# Altium schematic sheet FTDI_USB_To_UART.SchDoc
size A3; SheetNumber: 5; SheetTotal: 6
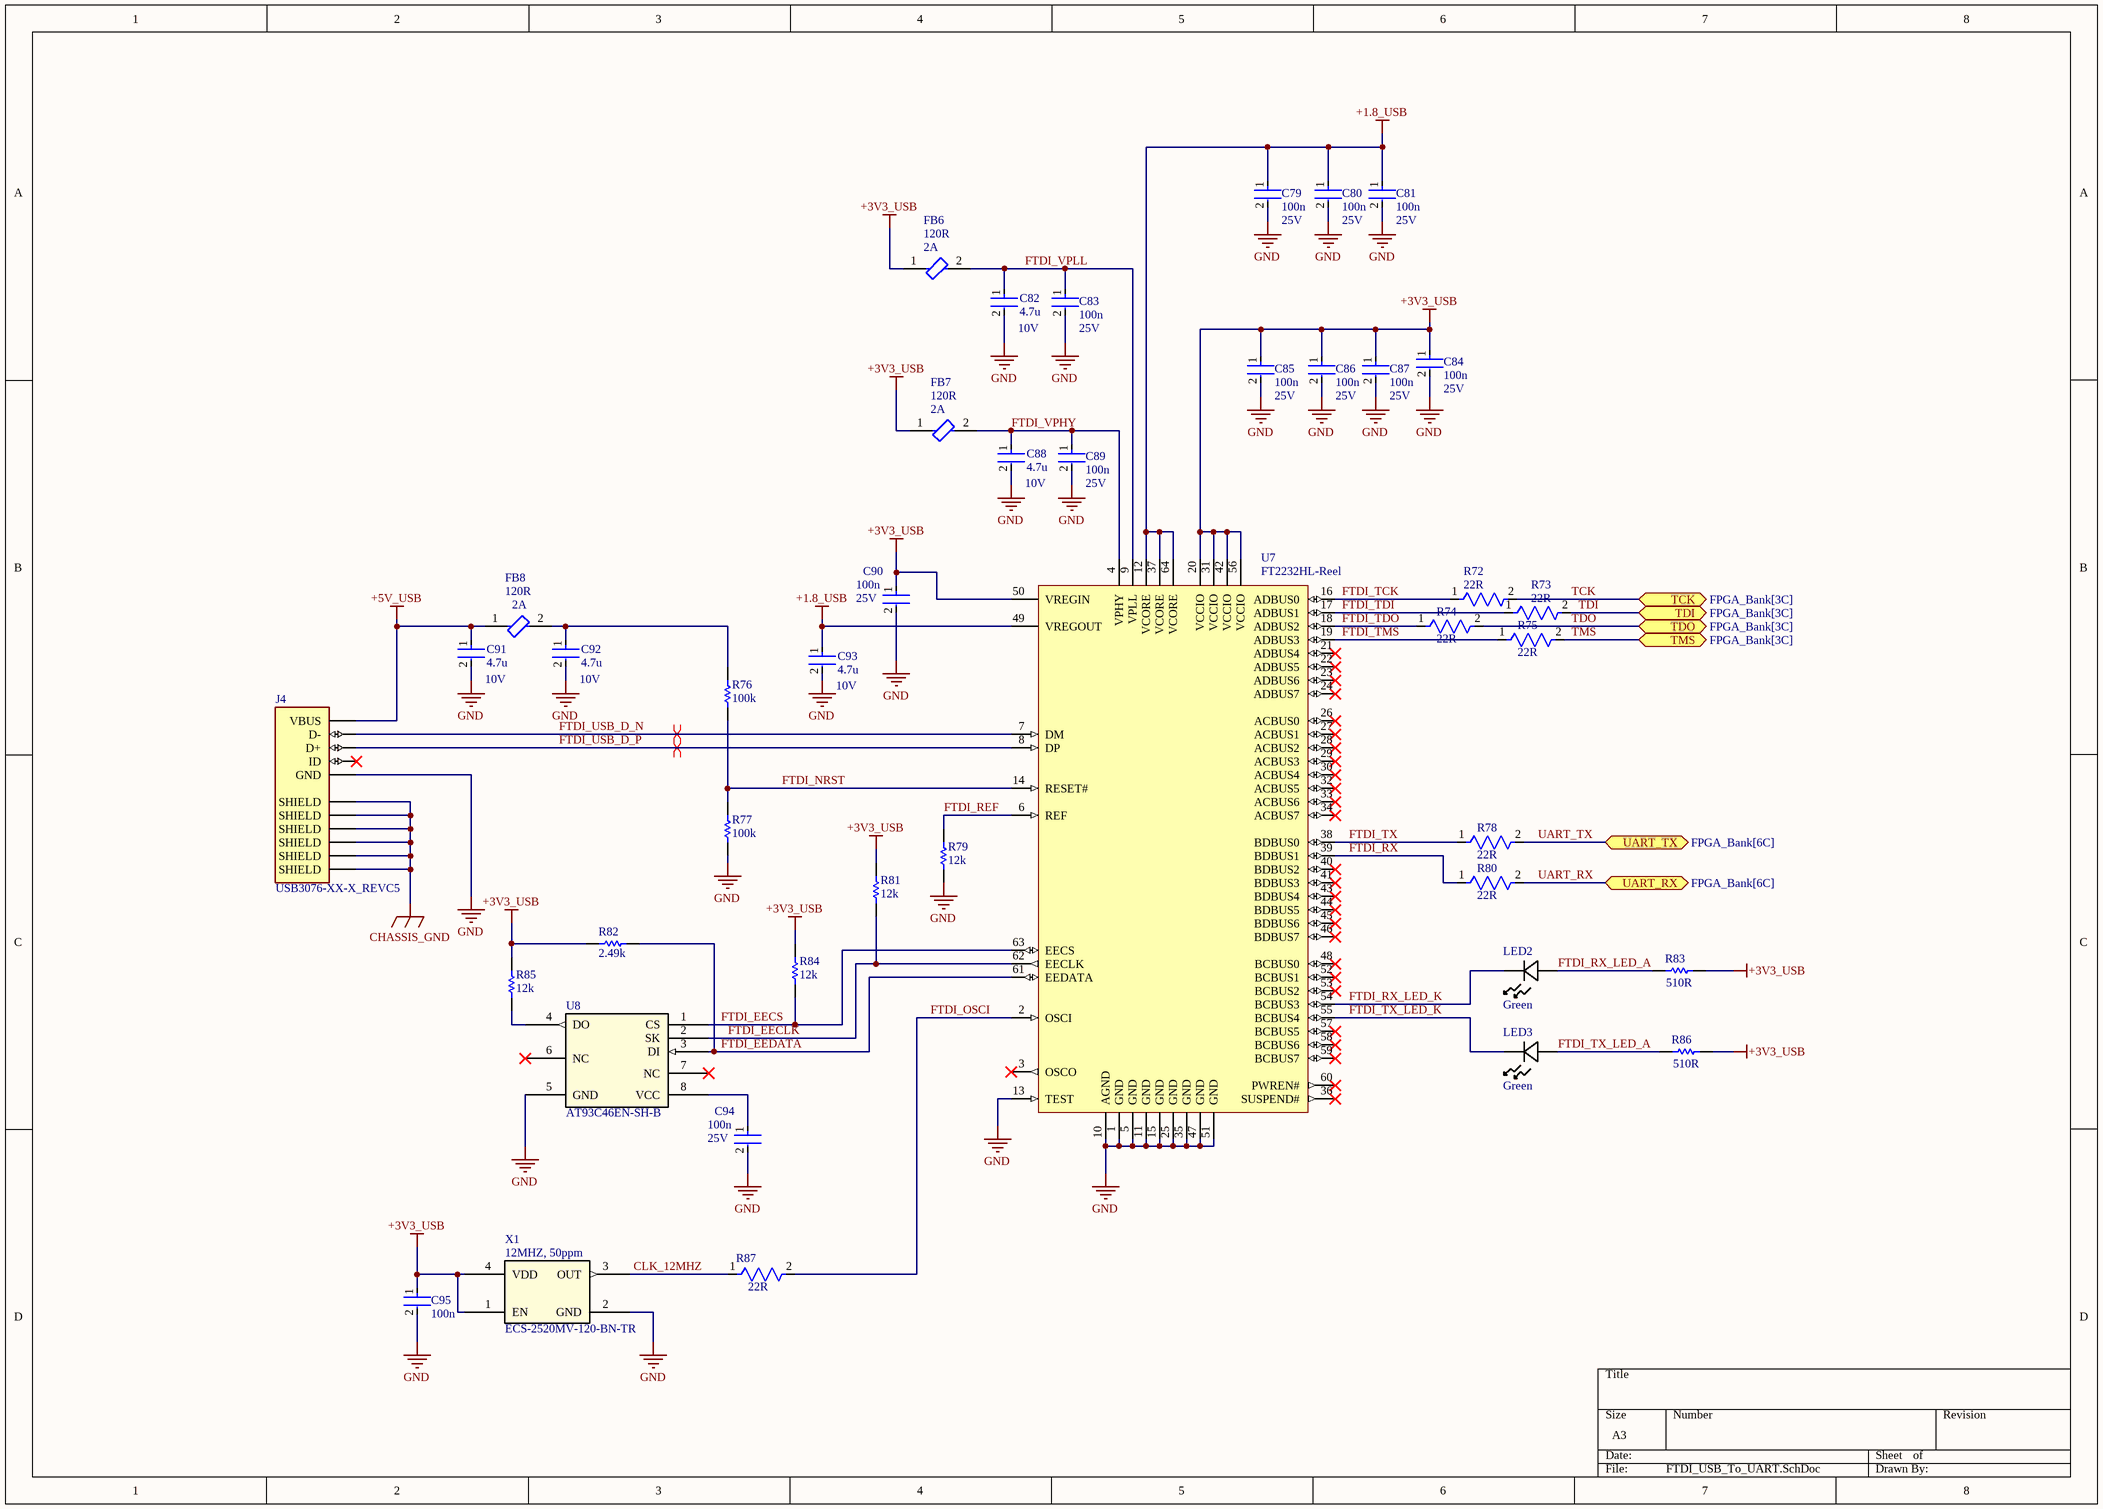
[diagram p0: FTDI_USB_To_UART.SchDoc]

## Parts
C79  100n  [FP-CL278-IPC_C]
C80  100n  [FP-CL278-IPC_C]
C81  100n  [FP-CL278-IPC_C]
C82  4.7u  [FP-CL282-IPC_C]
C83  100n  [FP-CL278-IPC_C]
C84  100n  [FP-CL278-IPC_C]
C85  100n  [FP-CL278-IPC_C]
C86  100n  [FP-CL278-IPC_C]
C87  100n  [FP-CL278-IPC_C]
C88  4.7u  [FP-CL282-IPC_C]
C89  100n  [FP-CL278-IPC_C]
C90  100n  [FP-CL278-IPC_C]
C91  4.7u  [FP-CL282-IPC_C]
C92  4.7u  [FP-CL282-IPC_C]
C93  4.7u  [FP-CL282-IPC_C]
C94  100n  [FP-CL278-IPC_C]
C95  100n  [FP-CL278-IPC_C]
FB6  120R  [FP-BLM15-0_05-d0_7-MFG]
FB7  120R  [FP-BLM15-0_05-d0_7-MFG]
FB8  120R  [FP-BLM15-0_05-d0_7-MFG]
J4  USB3076-XX-X_REVC5  [GCT_USB3076-XX-X_REVC5]
LED2  Green  [LED_LTW-C193TS5_LTO]
LED3  Green  [LED_LTW-C193TS5_LTO]
R72  22R  [FP-RC0402-0_4-MFG]
R73  22R  [FP-RC0402-0_4-MFG]
R74  22R  [FP-RC0402-0_4-MFG]
R75  22R  [FP-RC0402-0_4-MFG]
R76  100k  [RESC1005X40X25NL05T10]
R77  100k  [RESC1005X40X25NL05T10]
R78  22R  [FP-RC0402-0_4-MFG]
R79  12k  [RESC1005X40X25NL05T10]
R80  22R  [FP-RC0402-0_4-MFG]
R81  12k  [RESC1005X40X25NL05T10]
R82  2.49k  [RESC1005X40X25NL05T10]
R83  510R  [RESC1005X40X25LL05T05]
R84  12k  [RESC1005X40X25NL05T10]
R85  12k  [RESC1005X40X25NL05T10]
R86  510R  [RESC1005X40X25LL05T05]
R87  22R  [FP-RC0402-0_4-MFG]
U7  FT2232HL-Reel  [LQFP-64_M]
U8  AT93C46EN-SH-B  [8S1_ATM]
X1  ECS-2520MV-120-BN-TR  [SMD4_ECS-2520MV_ECS]

## Ports
TCK (bidir, see FPGA_Bank[3C]), TDI (bidir, see FPGA_Bank[3C]), TDO (bidir, see FPGA_Bank[3C]), TMS (bidir, see FPGA_Bank[3C]), UART_RX (bidir, see FPGA_Bank[6C]), UART_TX (bidir, see FPGA_Bank[6C])

## Nets
+1.8_USB: C79.1 C80.1 C81.1 C93.1 U7.12(VCORE) U7.37(VCORE) U7.49(VREGOUT) U7.64(VCORE)
+3V3_USB: C84.1 C85.1 C86.1 C87.1 C90.1 C95.1 FB6.1 FB7.1 R81.2 R82.1 R83.2 R84.2 R85.2 R86.2 U7.20(VCCIO) U7.31(VCCIO) U7.42(VCCIO) U7.50(VREGIN) U7.56(VCCIO) X1.1(EN) X1.4(VDD)
+5V_USB: C91.1 FB8.1 J4.1(VBUS)
CHASSIS_GND: J4.6(SHIELD) J4.7(SHIELD) J4.8(SHIELD) J4.9(SHIELD) J4.10(SHIELD) J4.11(SHIELD)
GND: C79.2 C80.2 C81.2 C82.2 C83.2 C84.2 C85.2 C86.2 C87.2 C88.2 C89.2 C90.2 C91.2 C92.2 C93.2 C94.2 C95.2 J4.5(GND) R77.1 R79.1 U7.1(GND) U7.5(GND) U7.10(AGND) U7.11(GND) U7.13(TEST) U7.15(GND) U7.25(GND) U7.35(GND) U7.47(GND) U7.51(GND) U8.5(GND) X1.2(GND)
CLK_12MHZ: R87.1 X1.3(OUT)
FTDI_EECLK: R81.1 U7.62(EECLK) U8.2(SK)
FTDI_EECS: R84.1 U7.63(EECS) U8.1(CS)
FTDI_EEDATA: R82.2 U7.61(EEDATA) U8.3(DI)
FTDI_NRST: R76.1 R77.2 U7.14(RESET#)
FTDI_OSCI: R87.2 U7.2(OSCI)
FTDI_REF: R79.2 U7.6(REF)
FTDI_RX: R80.1 U7.39(BDBUS1)
FTDI_RX_LED_A: LED2.2 R83.1
FTDI_RX_LED_K: LED2.1 U7.54(BCBUS3)
FTDI_TCK: R72.1 U7.16(ADBUS0)
FTDI_TDI: R73.1 U7.17(ADBUS1)
FTDI_TDO: R74.1 U7.18(ADBUS2)
FTDI_TMS: R75.1 U7.19(ADBUS3)
FTDI_TX: R78.1 U7.38(BDBUS0)
FTDI_TX_LED_A: LED3.2 R86.1
FTDI_TX_LED_K: LED3.1 U7.55(BCBUS4)
FTDI_USB_D_N: J4.2(D-) U7.7(DM)
FTDI_USB_D_P: J4.3(D+) U7.8(DP)
FTDI_VPHY: C88.1 C89.1 FB7.2 U7.4(VPHY)
FTDI_VPLL: C82.1 C83.1 FB6.2 U7.9(VPLL)
TCK: R72.2 ; port TCK
TDI: R73.2 ; port TDI
TDO: R74.2 ; port TDO
TMS: R75.2 ; port TMS
UART_RX: R80.2 ; port UART_RX
UART_TX: R78.2 ; port UART_TX
NetC92_1: C92.1 FB8.2 R76.2
NetC94_1: C94.1 U8.8(VCC)
NetR85_1: R85.1 U8.4(DO)

Not connected (* = marked no-connect by the designer): J4 4(ID)*; U7 3(OSCO)* 21(ADBUS4)* 22(ADBUS5)* 23(ADBUS6)* 24(ADBUS7)* 26(ACBUS0)* 27(ACBUS1)* 28(ACBUS2)* 29(ACBUS3)* 30(ACBUS4)* 32(ACBUS5)* 33(ACBUS6)* 34(ACBUS7)* 36(SUSPEND#)* 40(BDBUS2)* 41(BDBUS3)* 43(BDBUS4)* 44(BDBUS5)* 45(BDBUS6)* 46(BDBUS7)* 48(BCBUS0)* 52(BCBUS1)* 53(BCBUS2)* 57(BCBUS5)* 58(BCBUS6)* 59(BCBUS7)* 60(PWREN#)*; U8 6(NC)* 7(NC)*

## Layout directives
differential pair: FTDI_USB_D_N, FTDI_USB_D_P

## Notes on the sheet
- 25V
- (near C81) 25V
- (near FB6) 2A
- 10V
- (near C83) 25V
- (near FB7) 2A
- (near C84) 25V
- (near C89) 25V
- (near FB8) 2A
- (near C90) 25V
- (near C91) 10V
- (near C92) 10V
- (near C93) 10V
- (near C94) 25V
- (near X1) 12MHZ, 50ppm

## Library data of the parts
C79-C81 C83-C87 C89 C90 C94 C95 = CMP-13271-000728-1: Cap Ceramic 100nF 25V X5R ±10% SMD 0402 +85°C Paper T/R; Package Quantity: 1; Height: 0.5mm; Case Code (Metric): 1005; Thickness: 0.022inch; Mount: Surface Mount; Lead Free: Lead Free; Case Code (Imperial): 0402; Packaging: Tape and Reel; Depth: 0.5mm; Voltage: 25V; Min Operating Temperature: -55°C; Voltage Rating: 25V; Dielectric: X5R; Case/Package: 0402; Tolerance: 10%; Width: 0.02inch; Max Operating Temperature: 85°C; Capacitance: 100nF; Length: 1mm; Radiation Hardening: No; Voltage Rating (DC): 25V
C82 C88 C91-C93 = CMP-13271-000548-1: Cap Ceramic 4.7uF 10V X5R ±20% SMD 0402 +85°C Paper T/R; Capacitance: 4.7uF; Max Operating Temperature: 85°C; Lead Free: Lead Free; Tolerance: 20%; Voltage Rating: 10V; Dielectric: X5R; Width: 0.02inch; Length: 0.039inch; Case/Package: 0402; Min Operating Temperature: -55°C; Packaging: Tape and Reel; Thickness: 0.022inch; Case Code (Imperial): 0402; Package Quantity: 10000; Case Code (Metric): 1005; Mount: Surface Mount
FB6-FB8 = CMP-0686-00133-3: Chip Ferrite Bead, 0402, 120Ω @ 100MHz, 0.055Ω, 25%, 2A; DC Resistance (DCR): 55mR; Number of Circuits: 1; Material: Steel; Lead Free: Lead Free; Package Quantity: 10000; Impedance: 120R; Width: 0.5mm; Case Code (Metric): 1005; Test Frequency: 100MHz; Weight: 2.3E-05oz; Max DC Current: 2A; Current Rating: 2A; REACH SVHC: No SVHC; Case Code (Imperial): 0402; Min Operating Temperature: -55°C; Max Operating Temperature: 125°C; Max Current Rating: 2A; Series: EMIFIL®, BLM15P; Tolerance: 25%; Termination: SMD/SMT; Number of Lines: 1; Case/Package: 0402; RoHS Compliant: Yes; Number of Pins: 2; Length: 1mm; Height: 0.5mm; Packaging: Tape and Reel
J4 = USB3076-XX-X_REVC5: USB - micro B USB 2.0 Receptacle Connector 5 Position Surface Mount, Right Angle; Through Hole, 2.35mm profile, 5 Pins, Horizontal, Bottom mount; MP: USB3076-30-A; MF: Global Connector Technology; SnapEDA_Link: https://www.snapeda.com/parts/USB3076-30-A/Global+Connector+Technology/view-part/?ref=snap; Package: None; Check_prices: https://www.snapeda.com/parts/USB3076-30-A/Global+Connector+Technology/view-part/?ref=eda; Purchase-URL: https://pricing.snapeda.com/search/part/USB3076-30-A/?ref=eda; Price: None; Value: *; Availability: In Stock
LED2 LED3 = LTST-C191TGKT: No Description Available; Manufacturer_Name: LITE-ON; Copyright: Copyright (C) 2025 Ultra Librarian. All rights reserved.; Manufacturer_Part_Number: LTST-C191TGKT
R72-R75 R78 R80 R87 = CMP-2002-07520-2: Tolerance: 1%; Power Rating: 63mW; Voltage Rating: 50V; Temperature Coefficient: 100ppm/°C; Resistance: 22Ω; Termination: SMD/SMT; Depth: 500µm; Packaging: Tape & Reel; Height: 400µm; Width: 500µm; Case Code (Imperial): 0402; Length: 1mm; Schedule B: 8533210045, 8533210045; Case/Package: 0402; Max Operating Temperature: 155°C; Min Operating Temperature: -55°C; REACH SVHC: Unknown; RoHS: Compliant; Military Standard: Not; Voltage Rating (DC): 50V; Lead Free: Lead Free; Voltage Rating (AC): 50V; Number of Pins: 2; Composition: Thick Film
R76 R77 R79 R81 R84 R85 = CMP-2002-07343-1: Part Number: RC0402FR-07100KL; Manufacturer: Yageo / Phycomp
R82 = CMP-2002-07571-1: Part Number: RC0402FR-072K49L; Manufacturer: Yageo
R83 R86 = CMP-2002-00074-1: Part Number: CRCW0402510RFKED; Manufacturer: Vishay Dale
U7 = CMP-0078-00023-3: Dual High Speed USB To Multipurpose UART/FIFO IC, 64-pin LQFP, Tape and Reel; Manufacturer: FTDI; DatasheetVersion: ver 2.21, Jun-2012; ComponentLink1URL: http://www.ftdichip.com/; PartNumber: FT2232HL-Reel; ComponentLink2Description: Datasheet; RevisionNote: DatasheetVersion updated to 2.21 Jun-2012; PackageVersion: Jun-12; ComponentLink1Description: Manufacturer URL; ComponentLink2URL: http://www.ftdichip.com/Support/Documents/DataSheets/ICs/DS_FT2232H.pdf; PackageReference: LQFP-64; PackageDescription: 64-Pin Thin Quad Flat Pack, 10 x 10 x 1.4 mm Body, 0.5 mm Pitch
U8 = AT93C46EN-SH-B: No Description Available; Manufacturer_Name: Microchip; Copyright: Copyright (C) 2025 Ultra Librarian. All rights reserved.; Manufacturer_Part_Number: AT93C46EN-SH-B; RefDes: RefDes; Type: Type
X1 = ECS-2520MV-120-BN-TR: Description; Manufacturer_Name: ECS International; Copyright: Copyright (C) 2025 Ultra Librarian. All rights reserved.; Manufacturer_Part_Number: ECS-2520MV-120-BN-TR; RefDes: RefDes; Type: Type